# EAGLE design pannel_24_v5 (EAGLE 9.6.2)
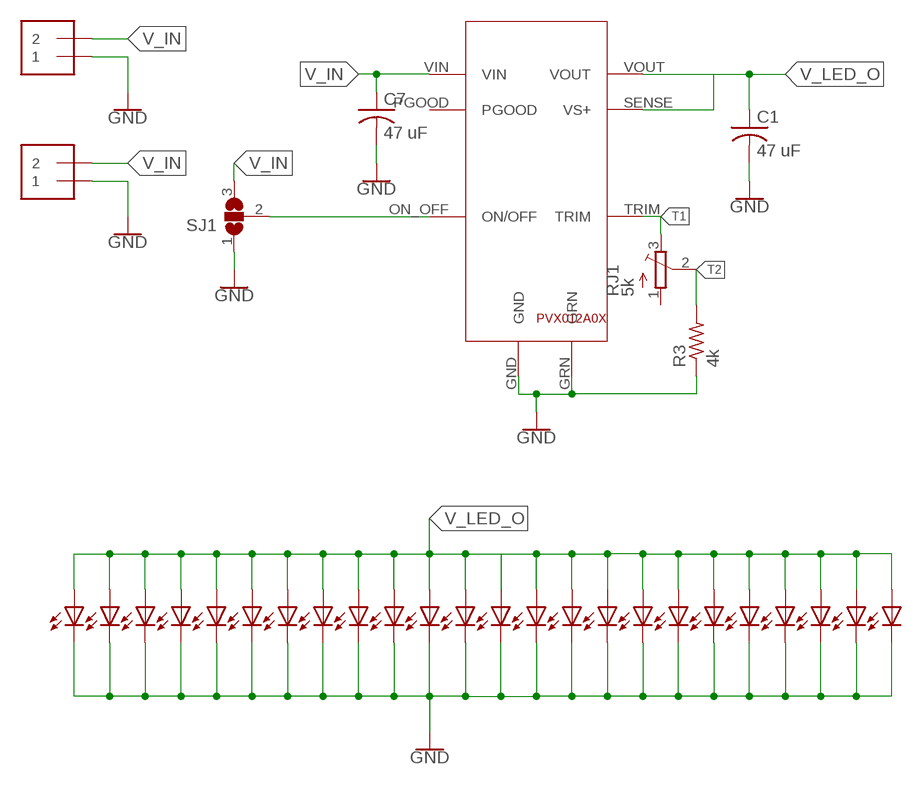
[diagram p0: schematic, sheet 1]

## Parts
C1  47 uF  C-USC1210  [C1210]
C7  47 uF  C-USC1210  [C1210]
R3  4k  R-US_R0603  [R0603]
RJ1  5k  TRIM_EU-3223W  [3223W]
SJ1  SJ2W  [SJ_2]
U$1  LED  [3WLED]
U$2  LED  [3WLED]
U$3  LED  [3WLED]
U$4  LED  [3WLED]
U$5  LED  [3WLED]
U$6  LED  [3WLED]
U$7  LED  [3WLED]
U$8  LED  [3WLED]
U$9  LED  [3WLED]
U$10  LED  [3WLED]
U$11  LED  [3WLED]
U$12  LED  [3WLED]
U$13  LED  [3WLED]
U$14  LED  [3WLED]
U$15  LED  [3WLED]
U$16  LED  [3WLED]
U$17  LED  [3WLED]
U$18  LED  [3WLED]
U$19  LED  [3WLED]
U$20  LED  [3WLED]
U$21  LED  [3WLED]
U$22  LED  [3WLED]
U$23  LED  [3WLED]
U$24  LED  [3WLED]
U$25  PVX012A0XV1  [PVX012A0X]
U$26  MOLEX_0039301022  [MINI-FIT_JR_CONN]
U$27  MOLEX_0039301022  [MINI-FIT_JR_CONN]

## Nets
GND: C1.2 C7.2 R3.1 SJ1.1 U$1.P$2(C) U$2.P$2(C) U$3.P$2(C) U$4.P$2(C) U$5.P$2(C) U$6.P$2(C) U$7.P$2(C) U$8.P$2(C) U$9.P$2(C) U$10.P$2(C) U$11.P$2(C) U$12.P$2(C) U$13.P$2(C) U$14.P$2(C) U$15.P$2(C) U$16.P$2(C) U$17.P$2(C) U$18.P$2(C) U$19.P$2(C) U$20.P$2(C) U$21.P$2(C) U$22.P$2(C) U$23.P$2(C) U$24.P$2(C) U$25.GND U$25.GRN U$26.P$2 U$27.P$2
ON_OFF: SJ1.2 U$25.ON_OFF(ON/OFF)
T1: RJ1.3(E) U$25.TRIM
T2: R3.2 RJ1.2(S)
V_IN: C7.1 SJ1.3 U$25.VIN U$26.P$1 U$27.P$1
V_LED_O: C1.1 U$1.P$1(A) U$2.P$1(A) U$3.P$1(A) U$4.P$1(A) U$5.P$1(A) U$6.P$1(A) U$7.P$1(A) U$8.P$1(A) U$9.P$1(A) U$10.P$1(A) U$11.P$1(A) U$12.P$1(A) U$13.P$1(A) U$14.P$1(A) U$15.P$1(A) U$16.P$1(A) U$17.P$1(A) U$18.P$1(A) U$19.P$1(A) U$20.P$1(A) U$21.P$1(A) U$22.P$1(A) U$23.P$1(A) U$24.P$1(A) U$25.SENSE(VS+) U$25.VOUT
Unconnected: RJ1.1(A) U$25.PGOOD

## Library data of the parts
C1 C7 = adafruit:C-US: CAPACITOR, American symbol
R3 = adafruit:R-US_: RESISTOR, American symbol
RJ1 = pot:TRIM_EU-: POTENTIOMETER
SJ1 = jumper:SJ2W: SMD solder JUMPER
U$1-U$24 = high_powered_led_packages__pcb_3w-_100w_arrays:LED
U$25 = PVX012A0X:PVX012A0X
U$26 U$27 = pat:MOLEX_0039301022

## Board
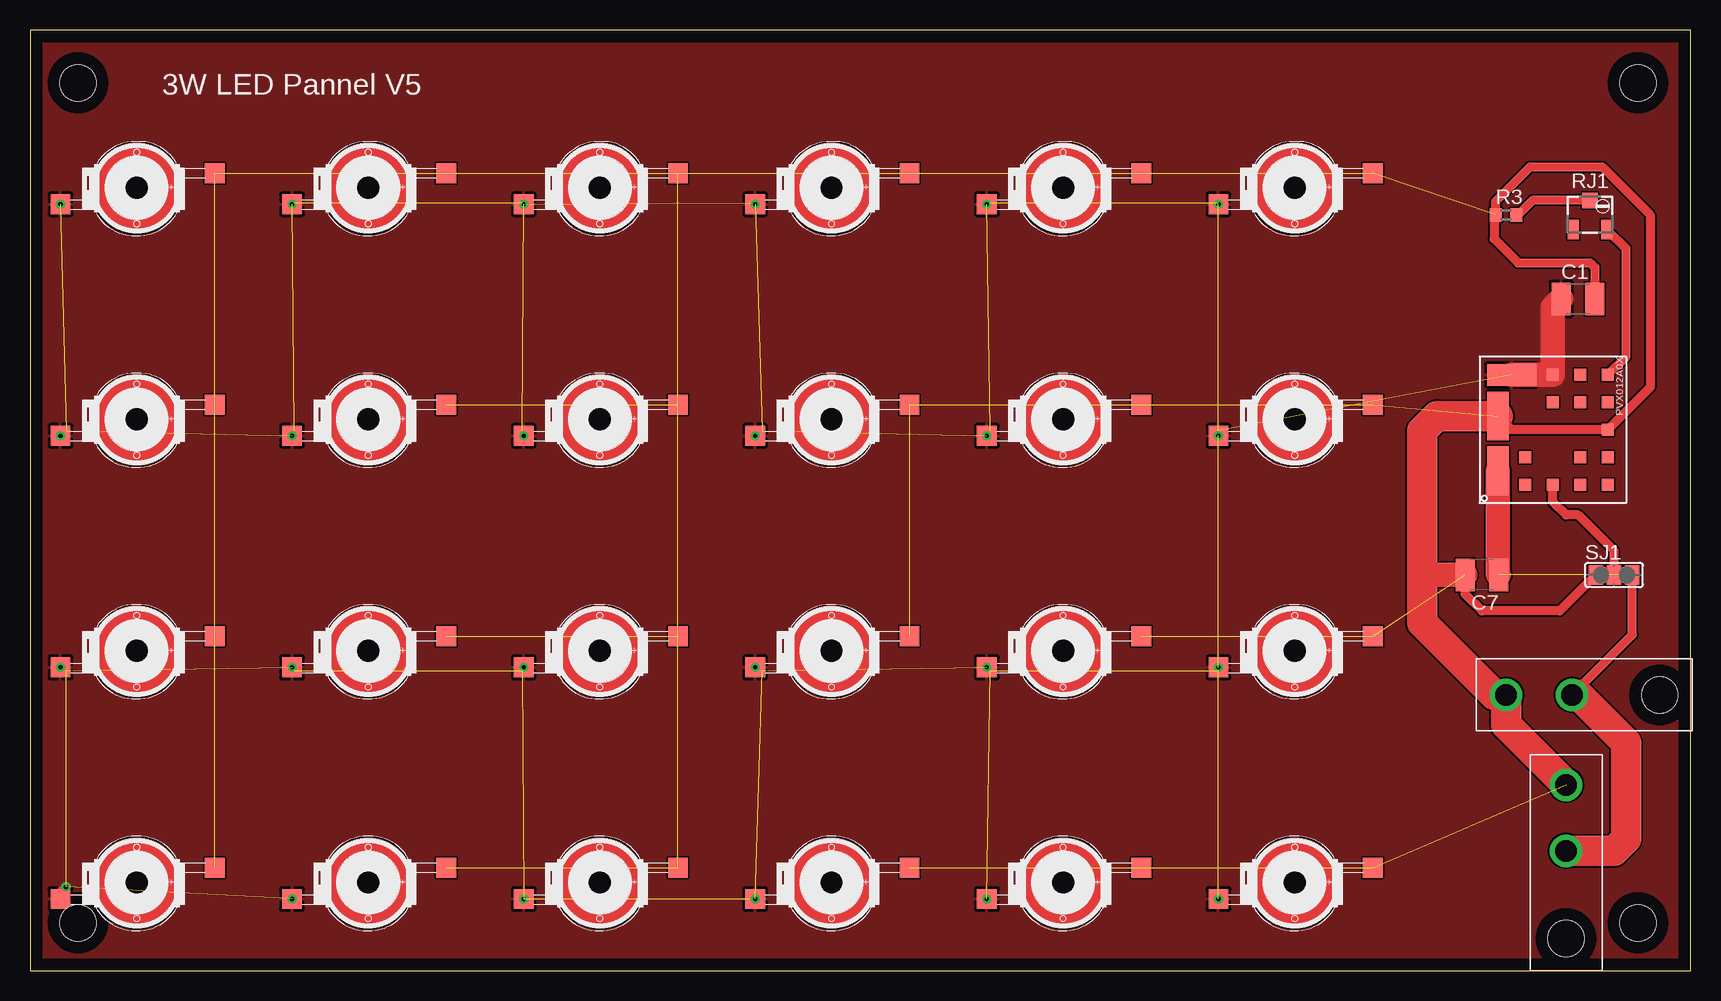
[diagram p1: board, top side]
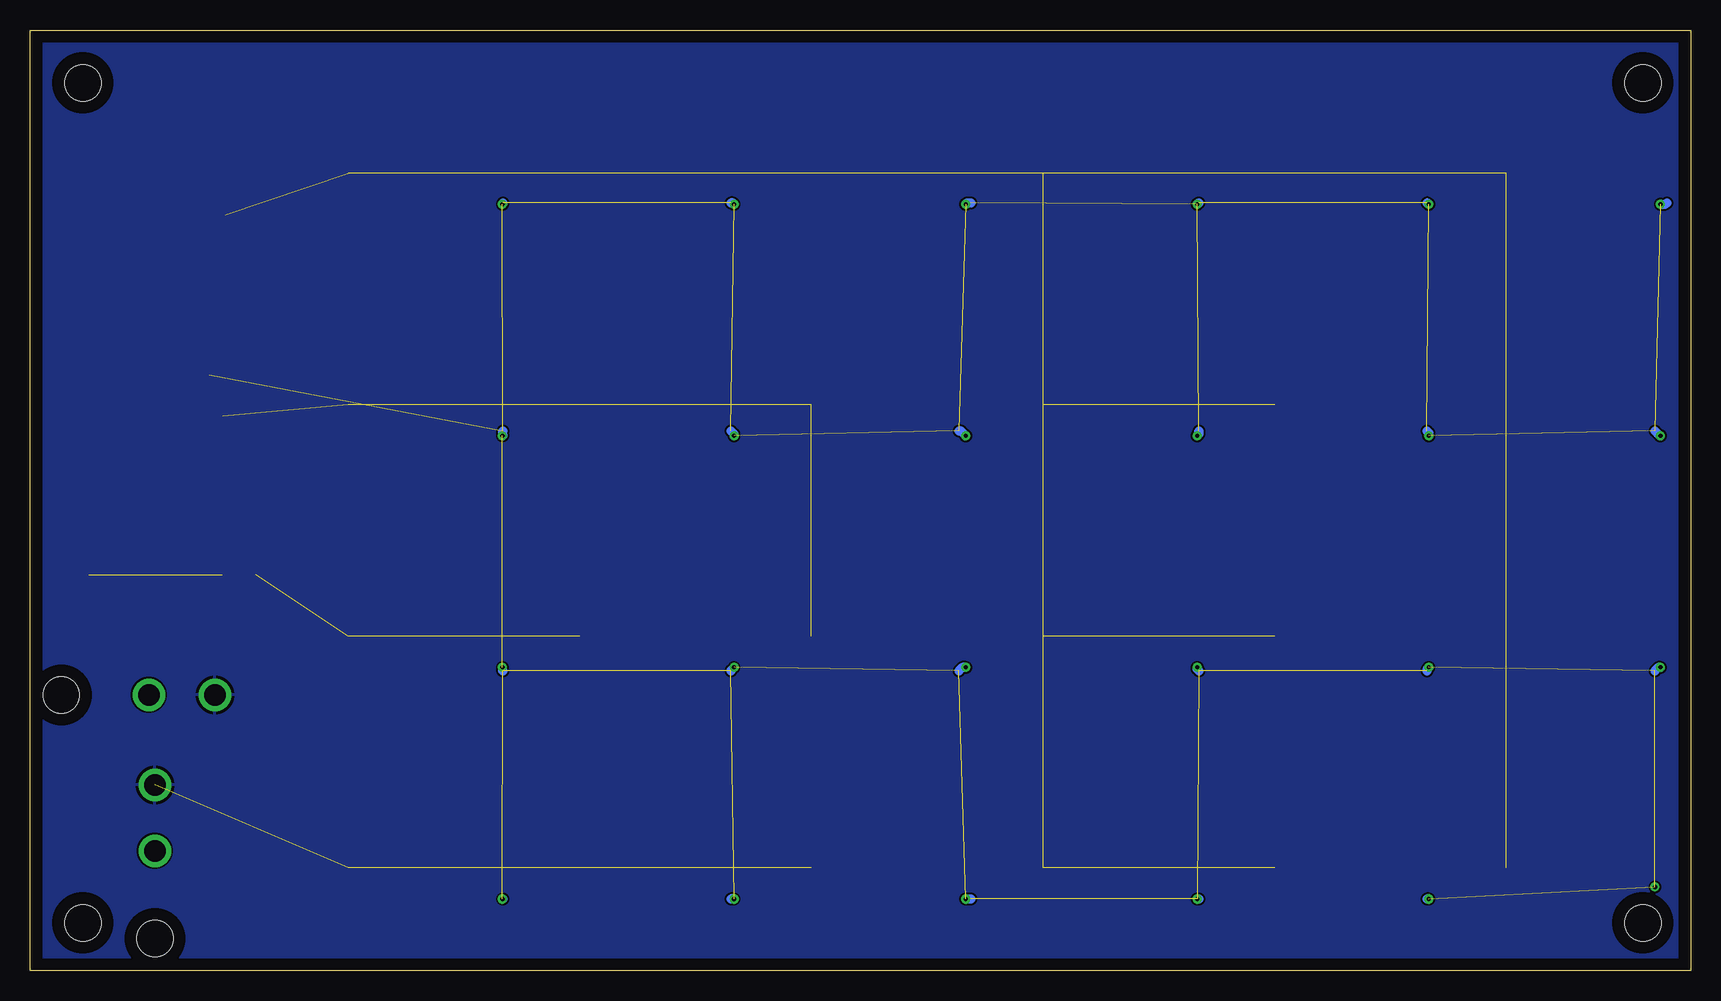
[diagram p2: board, bottom side, seen from below]

Size 138.41 x 78.41 mm. Coordinates in mm from the lower left corner, seen from the top.
Outline: 0,0 138.41,0 138.41,78.41 0,78.41 0,0
Copper layers (1*16): Top 0.035mm / dielectric 1.5mm / Bottom 0.035mm
Design rules "default": minimum track width 6mil, minimum drill 0.35mm, track to track 6mil, track to pad 6mil, pad to pad 6mil, via to via 6mil, smd to smd 6mil, copper to edge 40mil, drill to drill 6mil, minimum pad ring 10mil, minimum via ring 8mil, stop-mask expansion 4mil, vias tented up to drill 0mil, thermal gap 10mil
Holes 3.05 mm at 4,74 134,74 134,4 4,4

### Footprints (pad centres in the part's own frame; a part is rotated, then mirrored left to right if it is on the bottom)
C1210 = smd 1.6 x 2.7: 1 -1.4,0; 2 1.4,0
R0603 = smd 1 x 1.1: 1 -0.85,0; 2 0.85,0
3223W = smd 0.9 x 1.6: 1 -1.4,-1.215; 3 1.4,-1.215 | smd 1.3 x 1.3: 2 0,1.215
SJ_2 = smd 1.168 x 1.6: 1 -1.524,0; 2 0,0; 3 1.524,0
3WLED = smd 1.651 x 1.651: P$1 -6.35,-1.372; P$2 6.502,1.219
PVX012A0X = smd 1.01 x 1.01: 8 3.81,1.52; 9 1.52,1.52; 11 3.81,3.81; 12 8.39,3.81; 13 8.39,6.1; 14 10.68,3.81; 15 8.39,1.52; 16 1.52,8.39; 17 3.81,8.39; GND 6.1,1.52; ON_OFF 1.52,6.1; PGOOD 1.52,3.81; SENSE 10.68,6.1; TRIM 10.68,1.52 | smd 4.07 x 1.77: GRN 7.24,10.67; VIN 2.67,10.67 | smd 1.77 x 4.07: VOUT 10.67,9.53
MINI-FIT_JR_CONN = drill 1.8: P$1 0,0; P$2 0,5.5 | hole 3: 0,-7.3

### Placement (x,y rotation side)
C1  129,56 0 top
C7  121,33 180 top
R3  123,63 0 top
RJ1  130,63 0 top
SJ1  132,33 0 top
U$1  8.89,7.37 0 top
U$2  8.89,26.67 0 top
U$3  8.89,45.97 0 top
U$4  8.89,65.27 0 top
U$5  28.19,7.37 0 top
U$6  28.19,26.67 0 top
U$7  28.19,45.97 0 top
U$8  28.19,65.27 0 top
U$9  47.49,7.37 0 top
U$10  47.49,26.67 0 top
U$11  47.49,45.97 0 top
U$12  47.49,65.27 0 top
U$13  66.79,7.37 0 top
U$14  66.79,26.67 0 top
U$15  66.79,45.97 0 top
U$16  66.79,65.27 0 top
U$17  86.09,7.37 0 top
U$18  86.09,26.67 0 top
U$19  86.09,45.97 0 top
U$20  86.09,65.27 0 top
U$21  105.39,7.37 0 top
U$22  105.39,26.67 0 top
U$23  105.39,45.97 0 top
U$24  105.39,65.27 0 top
U$25  133,39 90 top
U$26  128,10 0 top
U$27  128.5,23 90 top

### Tracks (layer width: path | path; a pad name or v marks a point on that pad's centre or on a via)
GND  (24 unrouted)
  Top 0.762: U$25.GRN 123.47,45.1 U$25.GND 135,48.62 135,63 131,67 125,67 122.15,64.15 R3.1 122,62.85 122,61 124,59 130,59 130.4,58.6 C1.2 | SJ1.1 127.48,30 121,30 119.6,31.4 C7.2
  Top 2.032: C7.2 116,33
  Top 2.54: U$26.P$2 123,20.5 U$27.P$2 122,23 116,29 116,33 116,45 117.24,46.24 U$25.GRN
  pour Bottom: 0,0 0,78 139,78 139,0
ON_OFF
  Top 0.762: SJ1.2 132,35 129,38 128,38 126.9,39.1 U$25.ON_OFF
T1
  Top 0.762: U$25.TRIM 133,51.2 133,60.19 RJ1.3
T2
  Top 0.762: RJ1.2 125.22,64.22 124,63 R3.2
V_IN  (1 unrouted)
  Top 0.762: U$27.P$1 133.52,28.02 SJ1.3
  Top 2.032: U$25.VIN 122.33,33.07 C7.1
  Top 2.54: U$26.P$1 132,10 133,11 133,19 129,23 U$27.P$1
V_LED_O  (via drill 0.35)  (24 unrouted)
  Top 0.762: U$1.P$1 2.54,6.54 v3,7
  Top 2.032: U$25.VOUT U$25.SENSE 126.9,51 126.9,52 126.9,55.3 C1.1
  Bottom 0.762: U$22.P$1 99.04,25.04 99,25 | U$23.P$1 99,44.63 99,45 | U$19.P$1 79.74,44.74 80,45 | U$18.P$1 80,25.03 80,25 | U$14.P$1 60.71,25.29 61,25 | U$15.P$1 60.85,45 61,45 | U$11.P$1 41,44.73 41,45 | U$10.P$1 41.14,25.14 41,25 | U$5.P$1 22,6 | U$6.P$1 22,25.13 22,25 | U$2.P$1 2.71,25.29 3,25 | U$7.P$1 21.84,44.84 22,45 | U$24.P$1 99,63.93 99,64 | U$20.P$1 79.85,64 80,64 | U$16.P$1 60.33,64 60,64 | U$12.P$1 41.03,64 41,64 | U$8.P$1 21.95,64 22,64 | U$3.P$1 2.59,44.59 3,45 | U$4.P$1 2.11,63.89 2,64 | U$21.P$1 99.01,5.99 99,6 | U$17.P$1 80,6 | U$13.P$1 60.01,5.99 60,6 | U$9.P$1 41,6
  other vias: 99.04,25.29 99.04,44.59 79.74,44.59 79.74,25.29 60.44,25.29 60.44,44.59 41.14,44.59 41.14,25.29 21.84,5.99 21.84,25.29 2.54,25.29 21.84,44.59 99.04,63.89 79.74,63.89 60.44,63.89 41.14,63.89 21.84,63.89 2.54,44.59 2.54,63.89 99.04,5.99 79.74,5.99 60.44,5.99 41.14,5.99
  pour Top: 0,0 0,78 139,78 139,0

### Text on the board
tPlace: 3W LED Pannel V5